# Altium project PCB_Project_A.PrjPcb
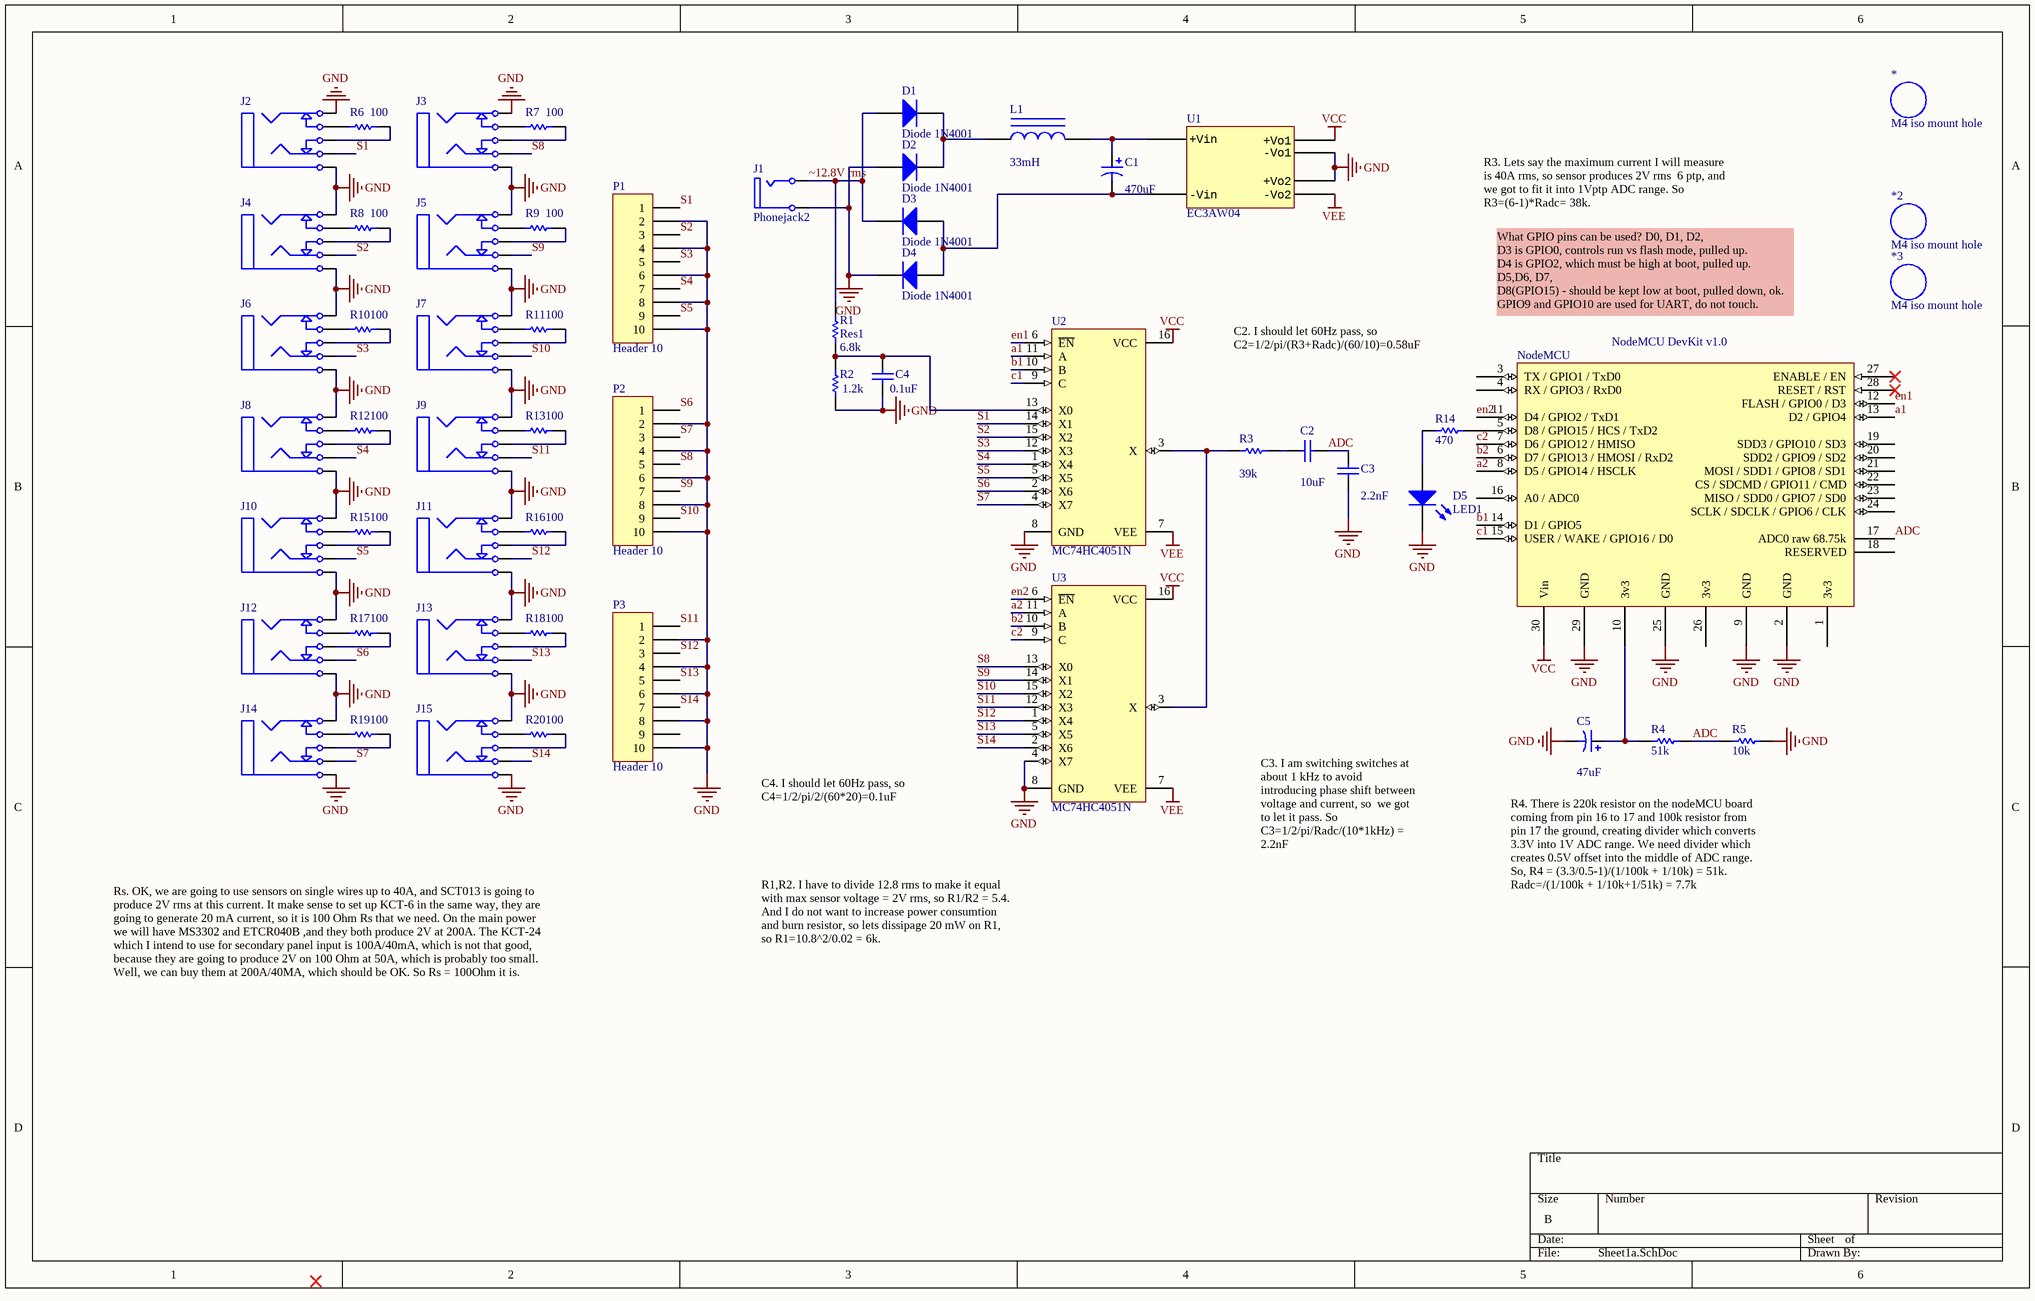
[diagram p0: Sheet1a.SchDoc]
1 sheet, 56 parts. Net scope: global (net labels, ports and power ports of the same name join across sheets).
Board file: PCB1a.PcbDoc

## Sheet Sheet1a.SchDoc
size B

### Parts
*  M4 iso mount hole  [M4 hole]  (no BOM)
*2  M4 iso mount hole  [M4 hole]  (no BOM)
*3  M4 iso mount hole  [M4 hole]  (no BOM)
C1  value 470uF  [CAPPR5-12.5x25]  (hidden comment: Cap Pol1)
C2  value 10uF  [RAD-0.3]  (hidden comment: Cap)
C3  value 2.2nF  [RAD-0.3]  (hidden comment: Cap)
C4  value 0.1uF  [RAD-0.3]  (hidden comment: Cap)
C5  value 47uF  [CAPPR2.5-6.3x6.8/H.9]  (hidden comment: Cap Pol1)
D1  Diode 1N4001  [DO-41]
D2  Diode 1N4001  [DO-41]
D3  Diode 1N4001  [DO-41]
D4  Diode 1N4001  [DO-41]
D5  LED1  [LED-1]
J1  Phonejack2  [Power jack 6x2mm]
J2  Phonejack Stereo SW  [SJ1-3515]  (value not drawn)
J3  Phonejack Stereo SW  [SJ1-3515]  (value not drawn)
J4  Phonejack Stereo SW  [SJ1-3515]  (value not drawn)
J5  Phonejack Stereo SW  [SJ1-3515]  (value not drawn)
J6  Phonejack Stereo SW  [SJ1-3515]  (value not drawn)
J7  Phonejack Stereo SW  [SJ1-3515]  (value not drawn)
J8  Phonejack Stereo SW  [SJ1-3515]  (value not drawn)
J9  Phonejack Stereo SW  [SJ1-3515]  (value not drawn)
J10  Phonejack Stereo SW  [SJ1-3515]  (value not drawn)
J11  Phonejack Stereo SW  [SJ1-3515]  (value not drawn)
J12  Phonejack Stereo SW  [SJ1-3515]  (value not drawn)
J13  Phonejack Stereo SW  [SJ1-3515]  (value not drawn)
J14  Phonejack Stereo SW  [SJ1-3515]  (value not drawn)
J15  Phonejack Stereo SW  [SJ1-3515]  (value not drawn)
L1  value 33mH  [Radial Vert Cylinder 10x19-6mm]  (hidden comment: Inductor Iron)
NodeMCU  NodeMCU DevKit v1.0  [NodeMCU v0.9]
P1  Header 10  [Spring Terminal]
P2  Header 10  [Spring Terminal]
P3  Header 10  [Spring Terminal]
R1  Res1  value 6.8k  [AXIAL-0.3]
R2  value 1.2k  [AXIAL-0.3]  (hidden comment: Res1)
R3  value 39k  [AXIAL-0.3]  (hidden comment: Res1)
R4  value 51k  [AXIAL-0.3]  (hidden comment: Res1)
R5  value 10k  [AXIAL-0.3]  (hidden comment: Res1)
R6  value 100  [AXIAL-0.3]  (hidden comment: Res1)
R7  value 100  [AXIAL-0.3]  (hidden comment: Res1)
R8  value 100  [AXIAL-0.3]  (hidden comment: Res1)
R9  value 100  [AXIAL-0.3]  (hidden comment: Res1)
R10  value 100  [AXIAL-0.3]  (hidden comment: Res1)
R11  value 100  [AXIAL-0.3]  (hidden comment: Res1)
R12  value 100  [AXIAL-0.3]  (hidden comment: Res1)
R13  value 100  [AXIAL-0.3]  (hidden comment: Res1)
R14  value 470  [AXIAL-0.3]  (hidden comment: Res1)
R15  value 100  [AXIAL-0.3]  (hidden comment: Res1)
R16  value 100  [AXIAL-0.3]  (hidden comment: Res1)
R17  value 100  [AXIAL-0.3]  (hidden comment: Res1)
R18  value 100  [AXIAL-0.3]  (hidden comment: Res1)
R19  value 100  [AXIAL-0.3]  (hidden comment: Res1)
R20  value 100  [AXIAL-0.3]  (hidden comment: Res1)
U1  EC3AW04  [EC3AW]
U2  MC74HC4051N  [648-08]
U3  MC74HC4051N  [648-08]

### Nets
GND: C3.1 C4.1 C5.2 D2.1(A) D4.2(K) D5.2(K) J1.5(S) J2.1-gnd J2.3-mid J3.1-gnd J3.3-mid J4.1-gnd J4.3-mid J5.1-gnd J5.3-mid J6.1-gnd J6.3-mid J7.1-gnd J7.3-mid J8.1-gnd J8.3-mid J9.1-gnd J9.3-mid J10.1-gnd J10.3-mid J11.1-gnd J11.3-mid J12.1-gnd J12.3-mid J13.1-gnd J13.3-mid J14.1-gnd J14.3-mid J15.1-gnd J15.3-mid NodeMCU.2(GND) NodeMCU.9(GND) NodeMCU.25(GND) NodeMCU.29(GND) P1.2 P1.4 P1.6 P1.8 P1.10 P2.2 P2.4 P2.6 P2.8 P2.10 P3.2 P3.4 P3.6 P3.8 P3.10 R2.2 R5.1 U1.3(+Vo2) U1.10(-Vo1) U2.8(GND) U3.4(X7) U3.8(GND)
VCC: NodeMCU.30(Vin) U1.11(+Vo1) U2.16(VCC) U3.16(VCC)
VEE: U1.2(-Vo2) U2.7(VEE) U3.7(VEE)
a1: NodeMCU.13(D2_/_GPIO4) U2.11(A)
a2: NodeMCU.8(D5_/_GPIO14_/_HSCLK) U3.11(A)
ADC: C2.1 C3.2 NodeMCU.17(ADC0_raw_68.75k) R4.1 R5.2
b1: NodeMCU.14(D1_/_GPIO5) U2.10(B)
b2: NodeMCU.6(D7_/_GPIO13_/_HMOSI_/_RxD2) U3.10(B)
c1: NodeMCU.15(USER_/_WAKE_/_GPIO16_/_D0) U2.9(C)
c2: NodeMCU.7(D6_/_GPIO12_/_HMISO) U3.9(C)
en1: NodeMCU.12(FLASH_/_GPIO0_/_D3) U2.6(~{EN})
en2: NodeMCU.11(D4_/_GPIO2_/_TxD1) U3.6(~{EN})
S1: J2.2-tip P1.1 U2.14(X1)
S2: J4.2-tip P1.3 U2.15(X2)
S3: J6.2-tip P1.5 U2.12(X3)
S4: J8.2-tip P1.7 U2.1(X4)
S5: J10.2-tip P1.9 U2.5(X5)
S6: J12.2-tip P2.1 U2.2(X6)
S7: J14.2-tip P2.3 U2.4(X7)
S8: J3.2-tip P2.5 U3.13(X0)
S9: J5.2-tip P2.7 U3.14(X1)
S10: J7.2-tip P2.9 U3.15(X2)
S11: J9.2-tip P3.1 U3.12(X3)
S12: J11.2-tip P3.3 U3.1(X4)
S13: J13.2-tip P3.5 U3.5(X5)
S14: J15.2-tip P3.7 U3.2(X6)
~12.8V rms: D1.1(A) D3.2(K) J1.1(T) R1.2
NetC1_1: C1.1 L1.2 U1.1(+Vin)
NetC1_2: C1.2 D3.1(A) D4.1(A) U1.12(-Vin)
NetC2_2: C2.2 R3.2
NetC4_2: C4.2 R1.1 R2.1 U2.13(X0)
NetC5_1: C5.1 NodeMCU.10(3v3) R4.2
NetD1_2: D1.2(K) D2.2(K) L1.1
NetD5_1: D5.1(A) R14.2
NetJ2_4-mid-sw: J2.4-mid-sw R6.1
NetJ2_5-tip-sw: J2.5-tip-sw R6.2
NetJ3_4-mid-sw: J3.4-mid-sw R7.1
NetJ3_5-tip-sw: J3.5-tip-sw R7.2
NetJ4_4-mid-sw: J4.4-mid-sw R8.1
NetJ4_5-tip-sw: J4.5-tip-sw R8.2
NetJ5_4-mid-sw: J5.4-mid-sw R9.1
NetJ5_5-tip-sw: J5.5-tip-sw R9.2
NetJ6_4-mid-sw: J6.4-mid-sw R10.1
NetJ6_5-tip-sw: J6.5-tip-sw R10.2
NetJ7_4-mid-sw: J7.4-mid-sw R11.1
NetJ7_5-tip-sw: J7.5-tip-sw R11.2
NetJ8_4-mid-sw: J8.4-mid-sw R12.1
NetJ8_5-tip-sw: J8.5-tip-sw R12.2
NetJ9_4-mid-sw: J9.4-mid-sw R13.1
NetJ9_5-tip-sw: J9.5-tip-sw R13.2
NetJ10_4-mid-sw: J10.4-mid-sw R15.1
NetJ10_5-tip-sw: J10.5-tip-sw R15.2
NetJ11_4-mid-sw: J11.4-mid-sw R16.1
NetJ11_5-tip-sw: J11.5-tip-sw R16.2
NetJ12_4-mid-sw: J12.4-mid-sw R17.1
NetJ12_5-tip-sw: J12.5-tip-sw R17.2
NetJ13_4-mid-sw: J13.4-mid-sw R18.1
NetJ13_5-tip-sw: J13.5-tip-sw R18.2
NetJ14_4-mid-sw: J14.4-mid-sw R19.1
NetJ14_5-tip-sw: J14.5-tip-sw R19.2
NetJ15_4-mid-sw: J15.4-mid-sw R20.1
NetJ15_5-tip-sw: J15.5-tip-sw R20.2
NetNodeMCU_5: NodeMCU.5(D8_/_GPIO15_/_HCS_/_TxD2) R14.1
NetR3_1: R3.1 U2.3(X) U3.3(X)

Not connected (* = marked no-connect by the designer): NodeMCU 1(3v3) 3(TX_/_GPIO1_/_TxD0) 4(RX_/_GPIO3_/_RxD0) 16(A0_/_ADC0) 18(RESERVED) 19(SDD3_/_GPIO10_/_SD3) 20(SDD2_/_GPIO9_/_SD2) 21(MOSI_/_SDD1_/_GPIO8_/_SD1) 22(CS_/_SDCMD_/_GPIO11_/_CMD) 23(MISO_/_SDD0_/_GPIO7_/_SD0) 24(SCLK_/_SDCLK_/_GPIO6_/_CLK) 26(3v3) 27(ENABLE_/_EN)* 28(RESET_/_RST)*; P3 9

### Notes on the sheet
- R3. Lets say the maximum current I will measure is 40A rms, so sensor produces 2V rms  6 ptp, and we got to fit it into 1Vptp ADC range. So R3=(6-1)*Radc= 38k.
- What GPIO pins can be used? D0, D1, D2,
  D3 is GPIO0, controls run vs flash mode, pulled up.
  D4 is GPIO2, which must be high at boot, pulled up.
  D5,D6, D7,
  D8(GPIO15) - should be kept low at boot, pulled down, ok.
  GPIO9 and GPIO10 are used for UART, do not touch.
- C2. I should let 60Hz pass, so C2=1/2/pi/(R3+Radc)/(60/10)=0.58uF
- C4. I should let 60Hz pass, so C4=1/2/pi/2/(60*20)=0.1uF
- C3. I am switching switches at about 1 kHz to avoid introducing phase shift between voltage and current, so  we got to let it pass. So C3=1/2/pi/Radc/(10*1kHz) = 2.2nF
- R4. There is 220k resistor on the nodeMCU board coming from pin 16 to 17 and 100k resistor from pin 17 the ground, creating divider which converts 3.3V into 1V ADC range. We need divider which creates 0.5V offset into the middle of ADC range. So, R4 = (3.3/0.5-1)/(1/100k + 1/10k) = 51k. Radc=/(1/100k + 1/10k+1/51k) = 7.7k
- R1,R2. I have to divide 12.8 rms to make it equal with max sensor voltage = 2V rms, so R1/R2 = 5.4.
  And I do not want to increase power consumtion and burn resistor, so lets dissipage 20 mW on R1, so R1=10.8^2/0.02 = 6k.
- Rs. OK, we are going to use sensors on single wires up to 40A, and SCT013 is going to
  produce 2V rms at this current. It make sense to set up KCT-6 in the same way, they are
  going to generate 20 mA current, so it is 100 Ohm Rs that we need. On the main power
  we will have MS3302 and ETCR040B ,and they both produce 2V at 200A. The KCT-24
  which I intend to use for secondary panel input is 100A/40mA, which is not that good,
  because they are going to produce 2V on 100 Ohm at 50A, which is probably too small.
  Well, we can buy them at 200A/40MA, which should be OK. So Rs = 100Ohm it is.

### Library data of the parts
C1 C5 = Cap Pol1: Polarized Capacitor (Radial); Published: 8-Jun-2000; LatestRevisionDate: 17-Jul-2002; LatestRevisionNote: Re-released for DXP Platform.; PackageReference: RB7.6-15; Publisher: Altium Limited; PackageDescription: Polarized Capacitor (Radial); 2 Leads
C2-C4 = Cap: Capacitor; Published: 8-Jun-2000; LatestRevisionDate: 17-Jul-2002; LatestRevisionNote: Re-released for DXP Platform.; PackageReference: RAD-0.3; Publisher: Altium Limited; PackageDescription: Radial Cap, Thru-Hole; 2 Leads; 0.3 in Pin Spacing
D1-D4 = Diode 1N4001: 1 Amp General Purpose Rectifier; Published: 8-Jun-2000; LatestRevisionDate: 17-Jul-2002; LatestRevisionNote: Re-released for DXP Platform.; DatasheetVersion: 1998; PackageVersion: Aug-1999; PackageReference: DO-41; Publisher: Altium Limited; PackageDescription: Diode, Axial; Body 5.2 x 2.7 mm (LxDia. max), Lead Dia. 0.86 mm (max); Code_JEDEC: DO-204-AL; ComponentLink1Description: Manufacturer Link; ComponentLink1URL: http://www.fairchildsemi.com/; ComponentLink2Description: Datasheet; ComponentLink2URL: http://www.fairchildsemi.com/ds/1N%2F1N4001.pdf
D5 = LED1: Typical RED GaAs LED; Published: 8-Jun-2000; LatestRevisionDate: 08-Jul-2005; LatestRevisionNote: Mech Layer 1 removed.; PackageReference: LED-1; Publisher: Altium Limited; PackageDescription: LED; 2 Leads
J1 = Phonejack2: Jack Socket, 1/4" [6.5mm], Thru-Hole, Vertical, 2-Conductor Open Circuit; pin to pad: 1>T 5>S; PackageDocument: 2003; PCB_Layout: Complies with manufacturer's recommendation.; DrillAndSlotSize: Corresponds to nominal value.; LatestRevisionDate: 15-Jul-2004; LatestRevisionNote: Component Replaced.; DatasheetDocument: 2003; PackageReference: S1VS_SNS; Publisher: Altium Limited; ComponentLink1Description: Manufacturer Link; ComponentLink1URL: http://www.cliffuk.co.uk/
J2-J15 = Phonejack Stereo SW: 3-Conductor Jack with 2 break contacts (normals) and 2 auxiliary make contacts; Published: 5-Jan-2004; LatestRevisionDate: 17-Dec-2003; LatestRevisionNote: PCB Footprint replaced.; DatasheetDocument: 07-Mar-2000; Publisher: Altium Limited; ComponentLink1Description: Manufacturer Link; ComponentLink1URL: http://domino.kycon.com/internet/Products.html
L1 = Inductor Iron: Magnetic-Core Inductor; Published: 24-Mar-1999; LatestRevisionDate: 17-Jul-2002; LatestRevisionNote: Re-released for DXP Platform.; PackageReference: AXIAL-0.9; Publisher: Altium Limited; PackageDescription: Axial Device, Thru-Hole; 2 Leads; 0.9 in Pin Spacing
P1-P3 = Header 10: Header, 10-Pin; LatestRevisionDate: 17-Jul-2002; LatestRevisionNote: Re-released for DXP Platform.; Publisher: Altium Limited
R1-R20 = Res1: Resistor; Published: 8-Jun-2000; LatestRevisionDate: 17-Jul-2002; LatestRevisionNote: Re-released for DXP Platform.; PackageReference: AXIAL-0.3; Publisher: Altium Limited; PackageDescription: Axial Device, Thru-Hole; 2 Leads; 0.3 in Pin Spacing
U1 = EC3AW04: Input Voltage: 9 V to 36 V; Isolation Voltage: 500 V; Number of Outputs: 2 Output; Output Power: 3 W; Brand: Cincon; Output Current-Channel 1: 300 mA; Output Voltage-Channel 1: 5 V; Output Voltage-Channel 2: - 5 V; Manufacturer PN: EC3AW04; Supplier 1: Mouser; Supplier Part Number 1: 418-EC3AW04; Manufacturer Part Number: EC3AW04; RoHS: RoHS Compliant; Category: Isolated DC/DC Converters; Stock 1: 17; Pricing 1: 1=13.19, 10=12.51, 50=12.27, 100=12.10, 500=10.67, 1000=9.96 (USD); Product: Isolated; Series: EC3AW; Mounting Style: Through Hole; Output Current-Channel 2: 300 mA; Standard Pack Qty: 1; RoHS - Mouser: Y; Minimum Order Quantity: 1; Reeling: False; ComponentLink1URL: http://www.mouser.com/ds/2/75/EC3AW-V14-541900.pdf; ComponentLink1Description: http://www.mouser.com/ds/2/75/EC3AW-V14-541900.pdf
U2 U3 = MC74HC4051N: 8-Channel Analog Multiplexer/Demultiplexer; Published: 15-Apr-2002; DatasheetVersion: 1995; PackageVersion: Apr-2000; PackageReference: 648-08; Publisher: Altium Limited; PackageDescription: DIP; 16 Leads; Row Spacing 7.62 mm; Pitch 2.54 mm; Code_JEDEC: MS-001-BB; ComponentLink1Description: Manufacturer Link; ComponentLink1URL: http://www.onsemi.com/; ComponentLink2Description: Datasheet; ComponentLink2URL: http://www.onsemi.com/pub/Collateral/MC74HC4051-D.PDF